# EAGLE schematic pH-meter-v1-1 (EAGLE 5.11)
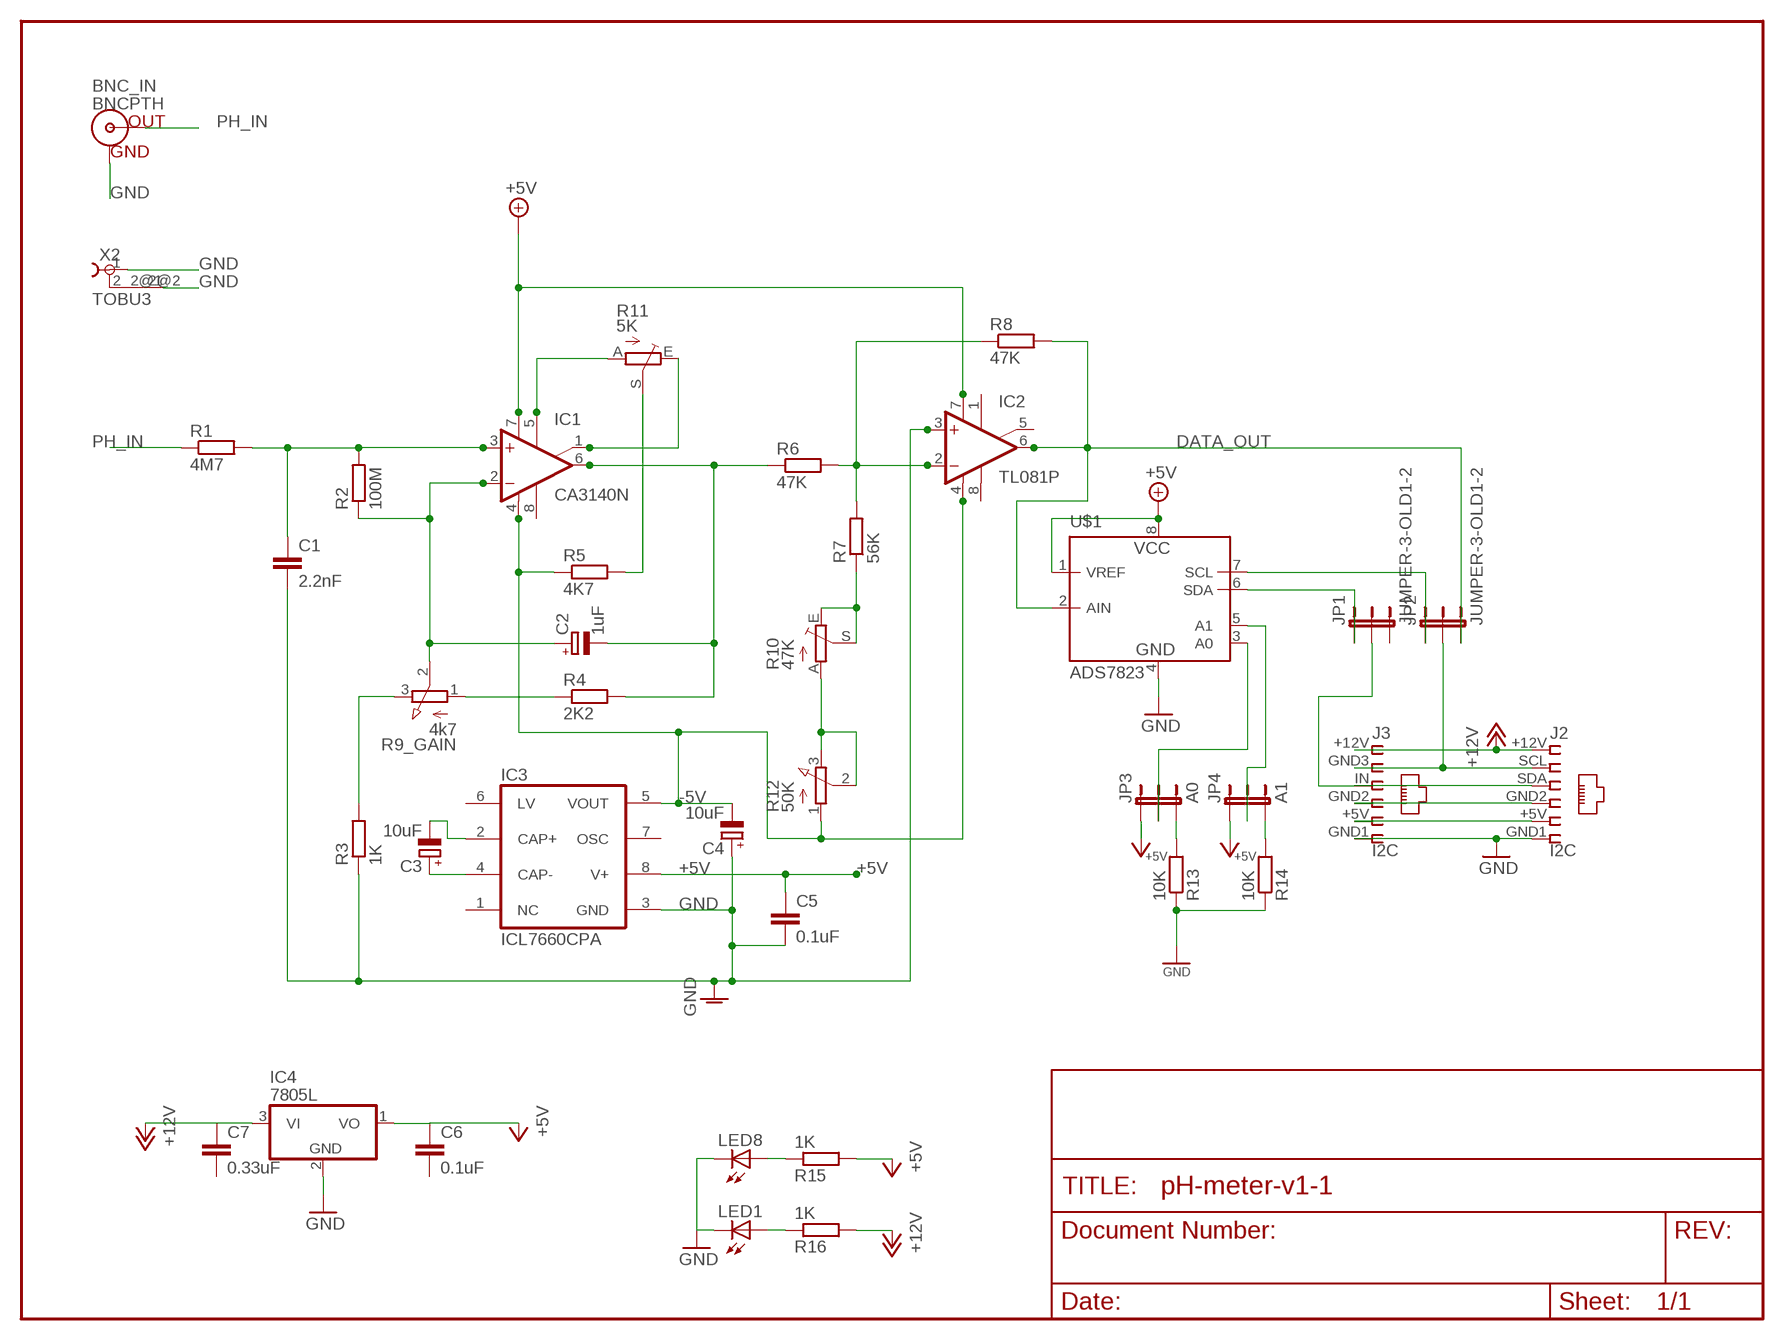
[diagram p0: schematic, sheet 1]

## Parts
BNC_IN  BNCPTH  [BNC]
C1  2.2nF  C-EU025-030X050  [C025-030X050]
C2  1uF  CPOL-EUE2-4  [E2-4]
C3  10uF  CPOL-EUE2-4  [E2-4]
C4  10uF  CPOL-EUE2-4  [E2-4]
C5  0.1uF  C-EU025-030X050  [C025-030X050]
C6  0.1uF  C-EU025-030X050  [C025-030X050]
C7  0.33uF  C-EU025-030X050  [C025-030X050]
IC1  CA3140N  [DIL08]
IC2  TL081P  [DIL08]
IC3  ICL7660CPA  [DIL08]
IC4  7805L  [TO92]
J2  I2C  RJ12STRAIGHT-I2C  [RJ12-STRAIGHT-I2C]
J3  I2C  RJ12STRAIGHT-ANALOG  [RJ12-STRAIGHT-ANALOG]
JP1  JUMPER-3-OLD1-2  [SJ_3_PASTE1&2]
JP2  JUMPER-3-OLD1-2  [SJ_3_PASTE1&2]
JP3  A0  JUMPER-3-OLD1-2  [SJ_3_PASTE1&2]
JP4  A1  JUMPER-3-OLD1-2  [SJ_3_PASTE1&2]
LED1  LED3MM  [LED3MM]
LED8  LED3MM  [LED3MM]
R1  4M7  R-EU_0309/12  [0309/12]
R2  100M  R-EU_0309/12  [0309/12]
R3  1K  R-EU_0309/12  [0309/12]
R4  2K2  R-EU_0309/12  [0309/12]
R5  4K7  R-EU_0309/12  [0309/12]
R6  47K  R-EU_0309/12  [0309/12]
R7  56K  R-EU_0309/12  [0309/12]
R8  47K  R-EU_0309/12  [0309/12]
R9_GAIN  4k7  3RP/1610N  [3RP/1610N]
R10  47K  TRIM_EU-LI15  [LI15]
R11  5K  TRIM_EU-LI15  [LI15]
R12  50K  3RP/1610N  [3RP/1610N]
R13  10K  R-EU_M1206  [M1206]
R14  10K  R-EU_M1206  [M1206]
R15  1K  R-EU_M1206  [M1206]
R16  1K  R-EU_M1206  [M1206]
U$1  ADS7823  [MSOP8]
X2  TOBU3  [TOBU3]

## Nets
+5V: C5.1 C6.1 IC1.7(V+) IC2.7(V+) IC3.8(V+) IC4.1(VO) JP3.1 JP4.1 R15.2 U$1.1(VREF) U$1.8(VCC)
+12V: C7.1 IC4.3(VI) J2.+12V J3.+12V R16.2
-5V: C4.- IC1.4(V-) IC2.4(V-) IC3.5(VOUT) R5.1 R12.1(A)
DATA_OUT: IC2.6(OUT) JP2.3 R8.2 U$1.2(AIN)
GND: BNC_IN.GND C1.2 C4.+ C5.2 IC2.3(+IN) IC3.3(GND) IC4.2(GND) J2.GND1 J2.GND2 J3.GND1 J3.GND2 LED1.K(C) LED8.K(C) R3.1 R13.1 R14.1 U$1.4(GND) X2.1 X2.2@2
N$1: C1.1 IC1.3(+IN) R1.2 R2.2
N$2: C2.+ IC1.2(-IN) R2.1 R9_GAIN.2(S)
N$3: R5.2 R11.S
N$4: IC1.5(ON) R11.A
N$5: IC1.1(ON/CMP) R11.E
N$6: C2.- IC1.6(OUT) R4.2 R6.1
N$7: R4.1 R9_GAIN.1(A)
N$8: R3.2 R9_GAIN.3(E)
N$9: R7.1 R10.E R10.S
N$10: R10.A R12.2(S) R12.3(E)
N$11: C3.- IC3.2(CAP+)
N$12: IC2.2(-IN) R6.2 R7.2 R8.1
N$13: C3.+ IC3.4(CAP-)
N$14: JP1.1 U$1.6(SDA)
N$15: JP2.1 U$1.7(SCL)
N$16: J2.SDA J3.IN JP1.2
N$17: J2.SCL J3.GND3 JP2.2
N$18: JP3.3 R13.2
N$19: JP4.3 R14.2
N$21: JP3.2 U$1.3(A0)
N$22: JP4.2 U$1.5(A1)
N$23: LED8.A R15.1
N$24: LED1.A R16.1
PH_IN: BNC_IN.S(OUT) R1.1
RJ12-5V: J2.+5V J3.+5V
Unconnected: C6.2 C7.2 IC1.8(CMP) IC2.1(ON1) IC2.5(ON2) IC2.8(OPT) IC3.1(NC) IC3.6(LV) IC3.7(OSC) JP1.3 X2.2 X2.2@1

## Library data of the parts
BNC_IN = SparkFun:BNC: BNC Connector, Mouser Part# 5227161
C1 C5-C7 = resistor:C-EU: CAPACITOR, European symbol
C2-C4 = resistor:CPOL-EU: POLARIZED CAPACITOR, European symbol
IC1 = linear:CA3140: OP AMP
IC2 = linear:TL081: OP AMP
IC3 = maxim:ICL7660CPA: VOLTAGE CONVERTER; MF: INTERSIL; MPN: ICL7660CPA; OC_FARNELL: 1018170; OC_NEWARK: 06F7441
IC4 = linear:78*: Positive VOLTAGE REGULATOR Source: http://cache.national.com/ds/LM/LM78L05.pdf http://www.fairchildsemi.com/ds/LM/LM7805.pdf
J2 J3 = lpatiny:RJ12: CORCOM Modular RJ Jacks No Shield Source: www.tycoelectronics.com .. ENG_DS_1654001_1099_RJ_L_0507.pdf
JP1-JP4 = SparkFun:JUMPER-3-OLD
LED1 LED8 = lpatiny:LED3MM
R1-R8 = rcl:R-EU_: RESISTOR, European symbol
R9_GAIN R12 = pot:3RP/1610N: 16mm Potentiometer one level Source: http://www.alphapotentiometers.net/html/16mm_pot_2.html
R10 R11 = pot:TRIM_EU-: POTENTIOMETER
R13-R16 = resistor:R-EU_: RESISTOR, European symbol
U$1 = lpatiny:ADS7823
X2 = con-hirschmann:TOBU3: Female Cinch CONNECTOR ( RCA Jack ); MF: FARNELL; MPN: TOBU 3; OC_FARNELL: 592791; OC_NEWARK: 06WX5914

## Net classes
2 highpower: width 1.372 mm